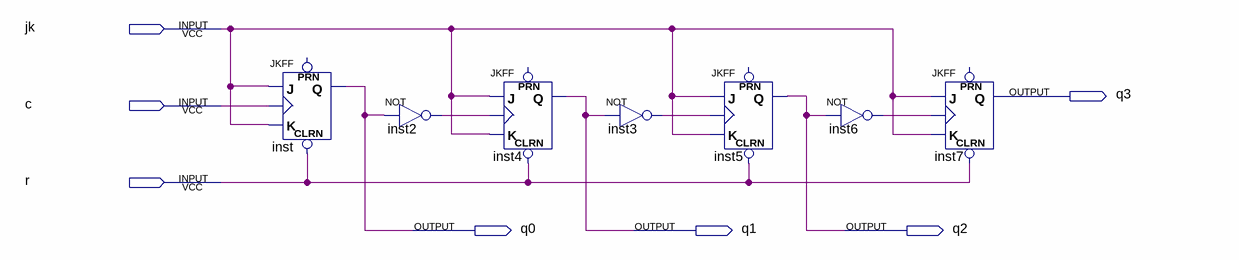
[diagram p0: schematic sheet]
// Quartus schematic p3_4bitcounter.bdf as structural Verilog: 7 symbols, 7 pins
module p3_4bitcounter (
  input  jk,
  input  c,
  input  r,
  output q3,
  output q0,
  output q1,
  output q2
);

  wire inst2_out, inst3_out, inst6_out;

  JKFF inst (.CLRN(r), .K(jk), .J(jk), .CLK(c), .Q(q0));  // open: PRN
  not inst2 (inst2_out, q0);
  JKFF inst4 (.CLRN(r), .K(jk), .J(jk), .CLK(inst2_out), .Q(q1));  // open: PRN
  not inst3 (inst3_out, q1);
  JKFF inst5 (.CLRN(r), .K(jk), .J(jk), .CLK(inst3_out), .Q(q2));  // open: PRN
  not inst6 (inst6_out, q2);
  JKFF inst7 (.CLRN(r), .K(jk), .J(jk), .CLK(inst6_out), .Q(q3));  // open: PRN
endmodule
